# Altium schematic sheet SPI.SchDoc
size A3
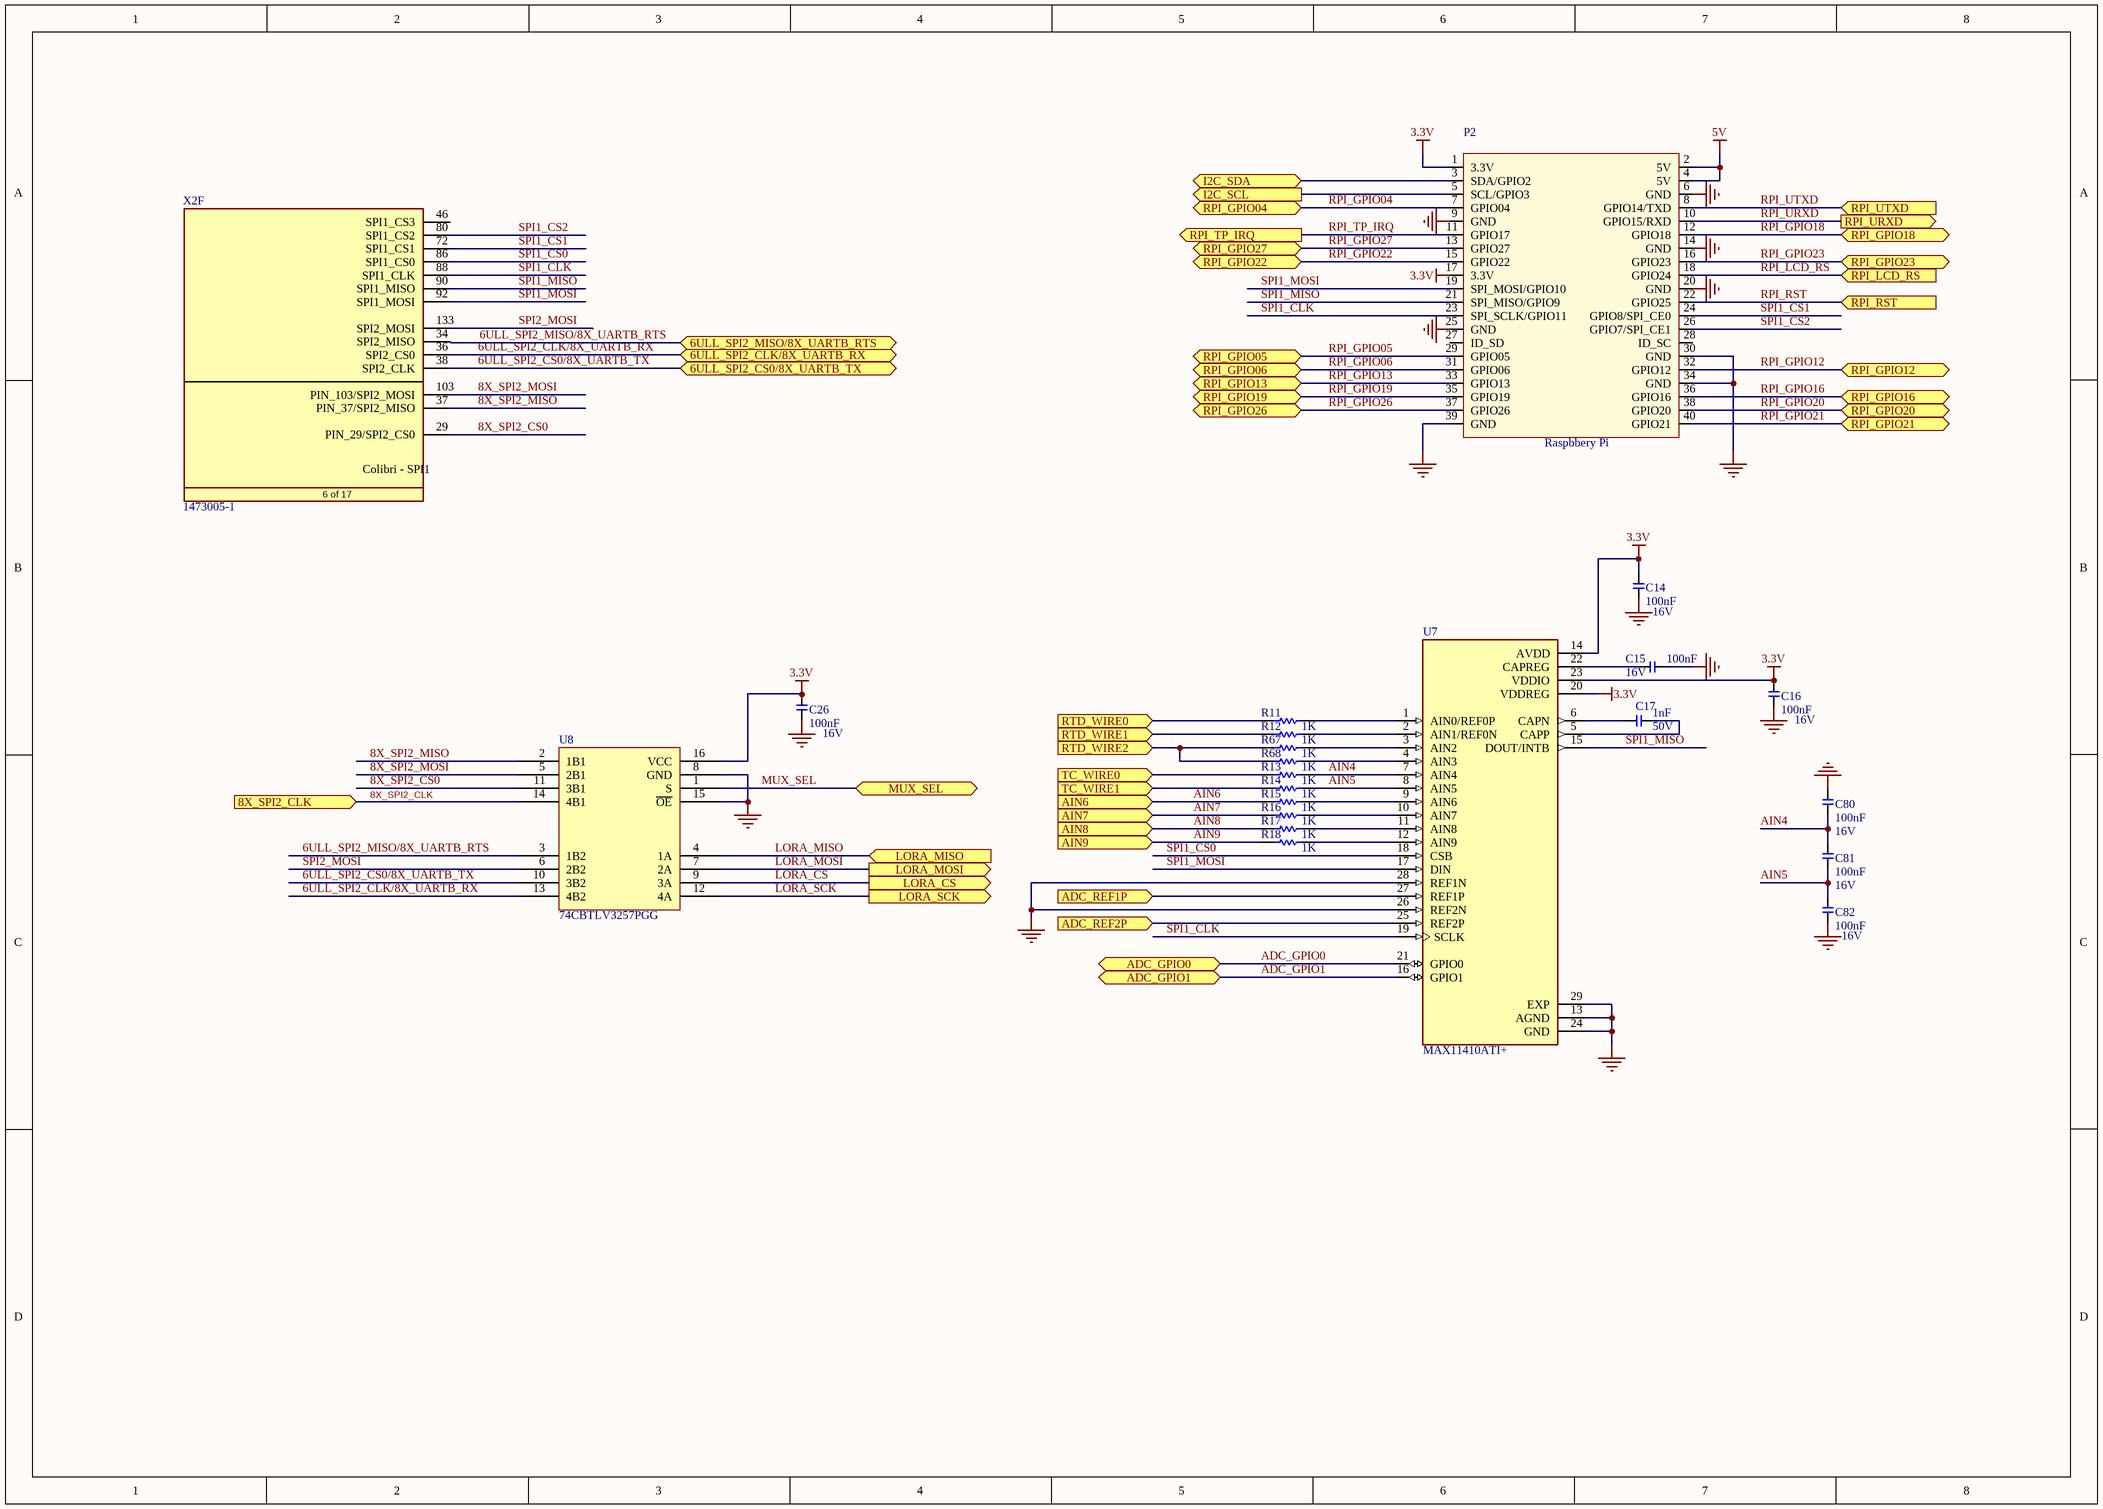
[diagram p0: SPI.SchDoc]

## Parts
C14  Rating: 16V  [T_CAPC0603X33N]  (hidden comment: 100nF)
C15  Rating: 16V  [T_CAPC0603X33N]  (hidden comment: 100nF)
C16  Rating: 16V  [T_CAPC0603X33N]  (hidden comment: 100nF)
C17  Rating: 50V  [CAPC1005X60N]  (hidden comment: 1nF)
C26  Rating: 16V  [T_CAPC0603X33N]  (hidden comment: 100nF)
C80  Rating: 16V  [T_CAPC0603X33N]  (hidden comment: 100nF)
C81  Rating: 16V  [T_CAPC0603X33N]  (hidden comment: 100nF)
C82  Rating: 16V  [T_CAPC0603X33N]  (hidden comment: 100nF)
P2  Raspbbery Pi  [RASPI_GPIO_B+]
R11  1K  [RESC1608X50N]
R12  1K  [RESC1608X50N]
R13  1K  [RESC1608X50N]
R14  1K  [RESC1608X50N]
R15  1K  [RESC1608X50N]
R16  1K  [RESC1608X50N]
R17  1K  [RESC1608X50N]
R18  1K  [RESC1608X50N]
R67  1K  [RESC1608X50N]
R68  1K  [RESC1608X50N]
U7  MAX11410ATI+  [QFN40P400X400X80-29N]
U8  74CBTLV3257PGG  [SOP65P640X120-16N]
X2  1473005-1  [T_Tyco_1473005-1]  (part F of 17)

## Ports
6ULL_SPI2_CLK/8X_UARTB_RX (bidir), 6ULL_SPI2_CS0/8X_UARTB_TX (bidir), 6ULL_SPI2_MISO/8X_UARTB_RTS (bidir), 8X_SPI2_CLK (in), ADC_GPIO0 (bidir), ADC_GPIO1 (bidir), ADC_REF1P (in), ADC_REF2P (in), AIN6 (in), AIN7 (in), AIN8 (in), AIN9 (in), I2C_SCL (out), I2C_SDA (bidir), LORA_CS (out), LORA_MISO (in), LORA_MOSI (out), LORA_SCK (out), MUX_SEL (bidir), RPI_GPIO04 (bidir), RPI_GPIO05 (bidir), RPI_GPIO06 (bidir), RPI_GPIO12 (bidir), RPI_GPIO13 (bidir), RPI_GPIO16 (bidir), RPI_GPIO18 (bidir), RPI_GPIO19 (bidir), RPI_GPIO20 (bidir), RPI_GPIO21 (bidir), RPI_GPIO22 (bidir), RPI_GPIO23 (bidir), RPI_GPIO26 (bidir), RPI_GPIO27 (bidir), RPI_LCD_RS (in), RPI_RST (in), RPI_TP_IRQ (out), RPI_URXD (out), RPI_UTXD (in), RTD_WIRE0 (in), RTD_WIRE1 (in), RTD_WIRE2 (in), TC_WIRE0 (in), TC_WIRE1 (in)

## Nets
3.3V: C14.2 C16.2 C26.2 P2.1(3.3V) P2.17(3.3V) U7.14(AVDD) U7.20(VDDREG) U7.23(VDDIO) U8.16(VCC)
5V: P2.2(5V) P2.4(5V)
GND: C14.1 C15.1 C16.1 C26.1 C80.2 C82.1 P2.6(GND) P2.9(GND) P2.14(GND) P2.20(GND) P2.25(GND) P2.30(GND) P2.34(GND) P2.39(GND) U7.13(AGND) U7.24(GND) U7.26(REF2N) U7.28(REF1N) U7.29(EXP) U8.8(GND) U8.15(~{OE})
6ULL_SPI2_CLK/8X_UARTB_RX: U8.13(4B2) X2.36(SPI2_CS0) ; port 6ULL_SPI2_CLK/8X_UARTB_RX
6ULL_SPI2_CS0/8X_UARTB_TX: U8.10(3B2) X2.38(SPI2_CLK) ; port 6ULL_SPI2_CS0/8X_UARTB_TX
6ULL_SPI2_MISO/8X_UARTB_RTS: U8.3(1B2) X2.34(SPI2_MISO) ; port 6ULL_SPI2_MISO/8X_UARTB_RTS
8X_SPI2_CLK: U8.14(4B1) ; port 8X_SPI2_CLK
8X_SPI2_CS0: U8.11(3B1) X2.29(PIN_29/SPI2_CS0)
8X_SPI2_MISO: U8.2(1B1) X2.37(PIN_37/SPI2_MISO)
8X_SPI2_MOSI: U8.5(2B1) X2.103(PIN_103/SPI2_MOSI)
ADC_GPIO0: U7.21(GPIO0) ; port ADC_GPIO0
ADC_GPIO1: U7.16(GPIO1) ; port ADC_GPIO1
ADC_REF1P: U7.27(REF1P) ; port ADC_REF1P
ADC_REF2P: U7.25(REF2P) ; port ADC_REF2P
AIN4: C80.1 C81.2 R13.2 U7.7(AIN4)
AIN5: C81.1 C82.2 R14.2 U7.8(AIN5)
AIN6: R15.1 ; port AIN6
AIN7: R16.1 ; port AIN7
AIN8: R17.1 ; port AIN8
AIN9: R18.1 ; port AIN9
I2C_SCL: P2.5(SCL/GPIO3) ; port I2C_SCL
I2C_SDA: P2.3(SDA/GPIO2) ; port I2C_SDA
LORA_CS: U8.9(3A) ; port LORA_CS
LORA_MISO: U8.4(1A) ; port LORA_MISO
LORA_MOSI: U8.7(2A) ; port LORA_MOSI
LORA_SCK: U8.12(4A) ; port LORA_SCK
MUX_SEL: U8.1(S) ; port MUX_SEL
RPI_GPIO04: P2.7(GPIO04) ; port RPI_GPIO04
RPI_GPIO05: P2.29(GPIO05) ; port RPI_GPIO05
RPI_GPIO06: P2.31(GPIO06) ; port RPI_GPIO06
RPI_GPIO12: P2.32(GPIO12) ; port RPI_GPIO12
RPI_GPIO13: P2.33(GPIO13) ; port RPI_GPIO13
RPI_GPIO16: P2.36(GPIO16) ; port RPI_GPIO16
RPI_GPIO18: P2.12(GPIO18) ; port RPI_GPIO18
RPI_GPIO19: P2.35(GPIO19) ; port RPI_GPIO19
RPI_GPIO20: P2.38(GPIO20) ; port RPI_GPIO20
RPI_GPIO21: P2.40(GPIO21) ; port RPI_GPIO21
RPI_GPIO22: P2.15(GPIO22) ; port RPI_GPIO22
RPI_GPIO23: P2.16(GPIO23) ; port RPI_GPIO23
RPI_GPIO26: P2.37(GPIO26) ; port RPI_GPIO26
RPI_GPIO27: P2.13(GPIO27) ; port RPI_GPIO27
RPI_LCD_RS: P2.18(GPIO24) ; port RPI_LCD_RS
RPI_RST: P2.22(GPIO25) ; port RPI_RST
RPI_TP_IRQ: P2.11(GPIO17) ; port RPI_TP_IRQ
RPI_URXD: P2.10(GPIO15/RXD) ; port RPI_URXD
RPI_UTXD: P2.8(GPIO14/TXD) ; port RPI_UTXD
RTD_WIRE0: R11.1 ; port RTD_WIRE0
RTD_WIRE1: R12.1 ; port RTD_WIRE1
RTD_WIRE2: R67.1 R68.1 ; port RTD_WIRE2
SPI1_CLK: P2.23(SPI_SCLK/GPIO11) U7.19(SCLK) X2.88(SPI1_CLK)
SPI1_CS0: U7.18(CSB) X2.86(SPI1_CS0)
SPI1_CS1: P2.24(GPIO8/SPI_CE0) X2.72(SPI1_CS1)
SPI1_CS2: P2.26(GPIO7/SPI_CE1) X2.80(SPI1_CS2)
SPI1_MISO: P2.21(SPI_MISO/GPIO9) U7.15(DOUT/INTB) X2.90(SPI1_MISO)
SPI1_MOSI: P2.19(SPI_MOSI/GPIO10) U7.17(DIN) X2.92(SPI1_MOSI)
SPI2_MOSI: U8.6(2B2) X2.133(SPI2_MOSI)
TC_WIRE0: R13.1 ; port TC_WIRE0
TC_WIRE1: R14.1 ; port TC_WIRE1
NetC15_2: C15.2 U7.22(CAPREG)
NetC17_1: C17.1 U7.5(CAPP)
NetC17_2: C17.2 U7.6(CAPN)
NetR11_2: R11.2 U7.1(AIN0/REF0P)
NetR12_2: R12.2 U7.2(AIN1/REF0N)
NetR15_2: R15.2 U7.9(AIN6)
NetR16_2: R16.2 U7.10(AIN7)
NetR17_2: R17.2 U7.11(AIN8)
NetR18_2: R18.2 U7.12(AIN9)
NetR67_2: R67.2 U7.3(AIN2)
NetR68_2: R68.2 U7.4(AIN3)

Not connected (* = marked no-connect by the designer): P2 27(ID_SD) 28(ID_SC); X2 46(SPI1_CS3)

## Notes on the sheet
- (in symbol CON-Tyco-1473005-1-200-0.6mm, part F) Colibri - SPI1; 6 of 17

## Library data of the parts
C14-C16 C26 C80-C82 = C-X7R-100nF-16V-10%-0603: Capacitor Ceramic X7R 100nF 16V 10% 0603; Tolerance: 10%; Type: X7R; Value: 100nF
C17 = C-X7R-1nF-50V-10%-0402: Capacitor Ceramic X7R 1nF 50V 10% 0402; Tolerance: 10%; Type: X7R; Value: 1nF
P2 = RASPI_GPIO_B+_PIN
R11-R18 R67 R68 = Res1: Resistor; mpn: CRCW060310K0FKEAHP; E14: 1738918; LatestRevisionDate: 17-Jul-2002; LatestRevisionNote: Re-released for DXP Platform.; PackageReference: AXIAL-0.3; PackageDescription: Axial Device, Thru-Hole; 2 Leads; 0.3 in Pin Spacing; Value: 1K
U7 = MAX11410ATI+: 24 Bit Analog to Digital Converter 5, 10 Input 1 Sigma-Delta 28-TQFN _4x4_; MF: Maxim Integrated; Package: TQFN-28 Maxim; MP: MAX11410ATI+; Price: None; Availability: Unavailable; Value: *; SnapEDA_Link: https://www.snapeda.com/parts/MAX11410ATI+/Maxim%20Integrated/view-part/1232119/?ref=snap
X2 = CON-Tyco-1473005-1-200-0.6mm: SODIMM Connector; Manufacturer Name: Tyco; No. of ways: 200; Manufacturer Part No.: 1473005-1